# EAGLE design PCB-Extended (EAGLE 9.6.2)
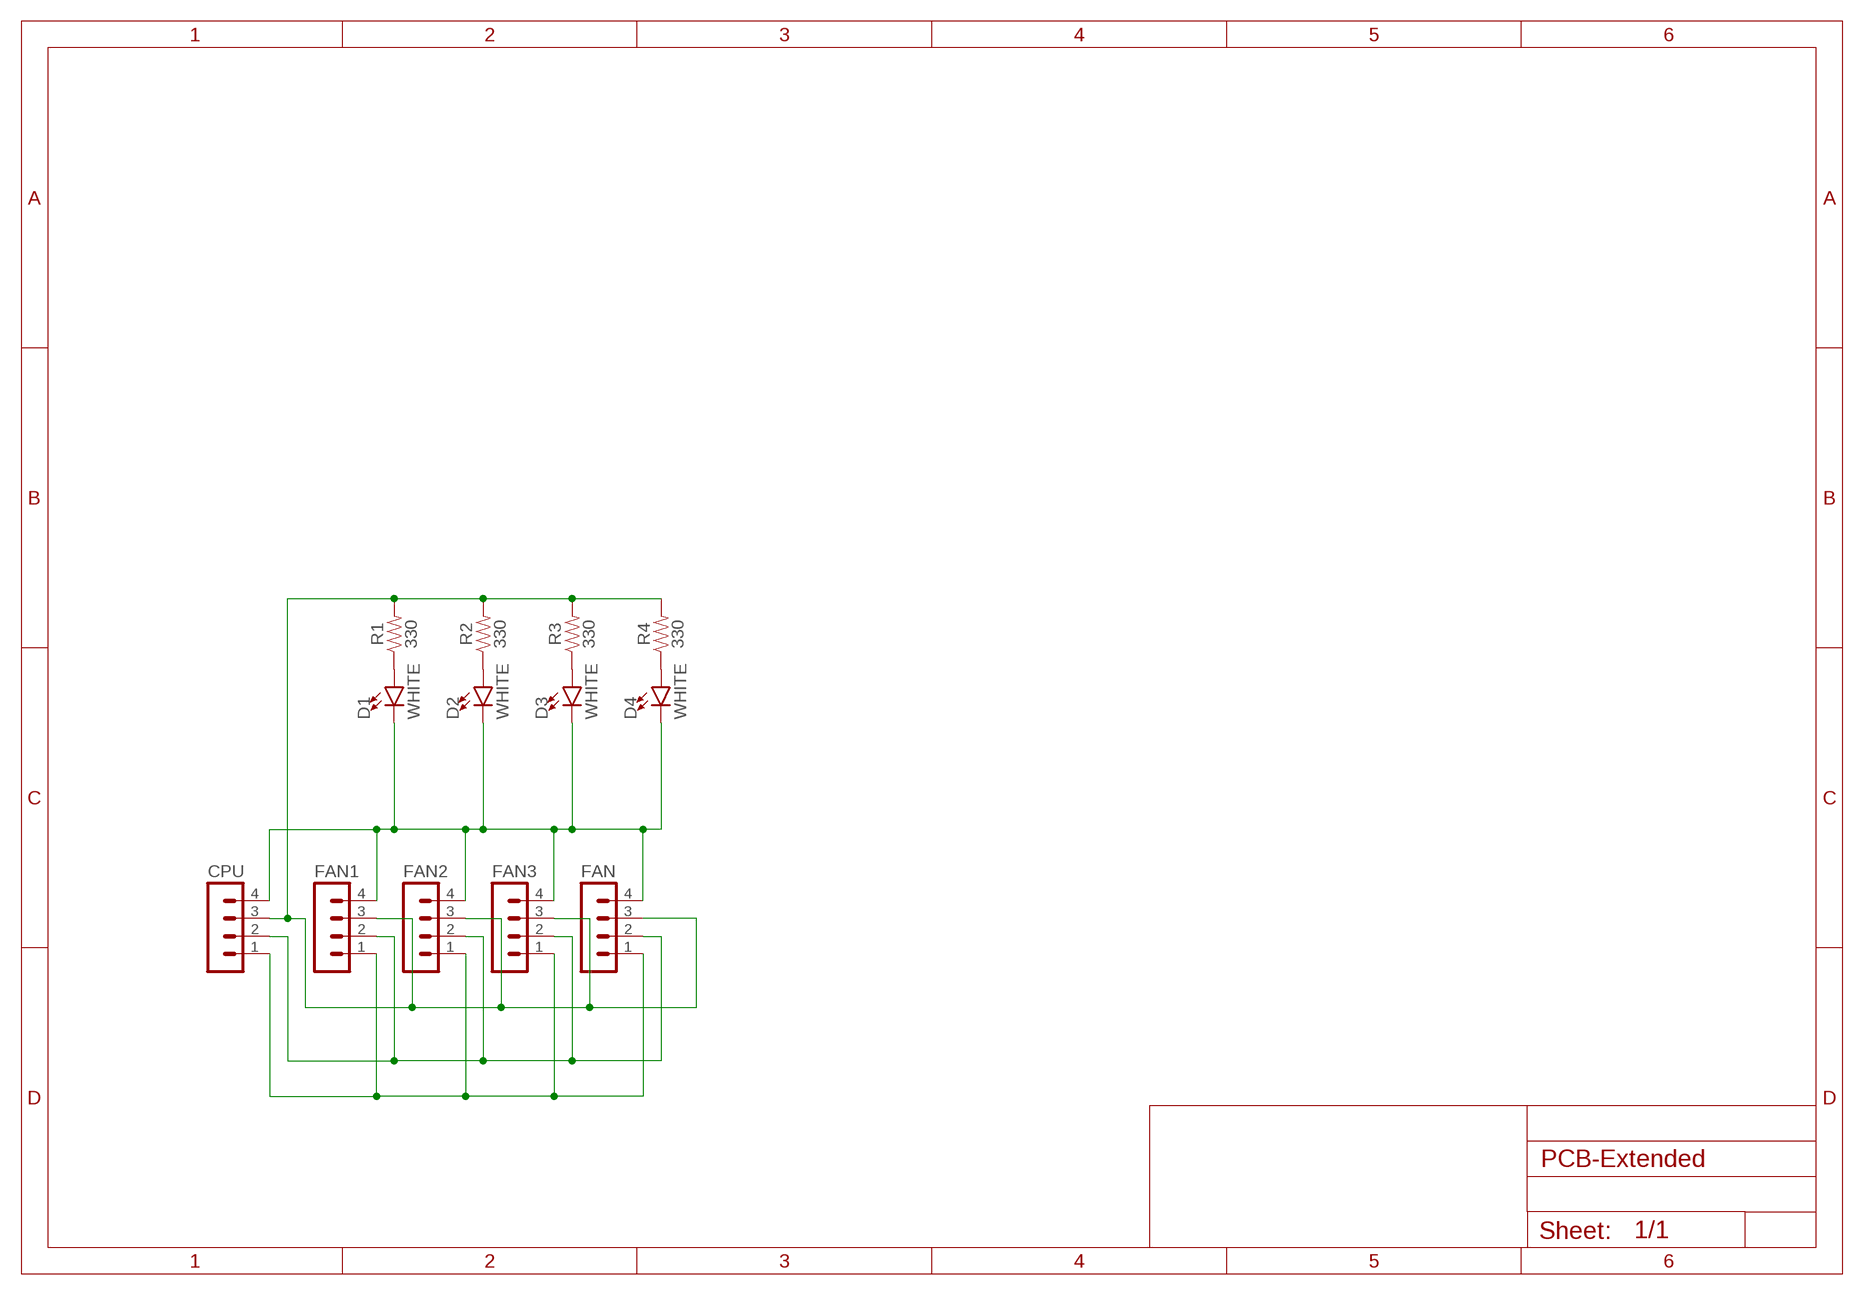
[diagram p0: schematic, sheet 1]

## Parts
CPU  MA04-1  [MA04-1]
D1  WHITE  LED-WHITE1206  [LED-1206]
D2  WHITE  LED-WHITE1206  [LED-1206]
D3  WHITE  LED-WHITE1206  [LED-1206]
D4  WHITE  LED-WHITE1206  [LED-1206]
FAN  MA04-1  [MA04-1]
FAN1  MA04-1  [MA04-1]
FAN2  MA04-1  [MA04-1]
FAN3  MA04-1  [MA04-1]
R1  330  0.27OHM-0603-1/10W-1%  [0603]
R2  330  0.27OHM-0603-1/10W-1%  [0603]
R3  330  0.27OHM-0603-1/10W-1%  [0603]
R4  330  0.27OHM-0603-1/10W-1%  [0603]

## Nets
FAN: CPU.2 FAN1.2 FAN2.2 FAN3.2 FAN.2
N$1: CPU.1 FAN1.1 FAN2.1 FAN3.1 FAN.1
N$6: CPU.4 D1.C D2.C D3.C D4.C FAN1.4 FAN2.4 FAN3.4 FAN.4
N$8: CPU.3 FAN1.3 FAN2.3 FAN3.3 FAN.3 R1.2 R2.2 R3.2 R4.2
N$9: D1.A R1.1
N$10: D2.A R2.1
N$11: D3.A R3.1
N$12: D4.A R4.1

## Library data of the parts
CPU FAN FAN1-FAN3 = con-lstb:MA04-1: PIN HEADER; OC_FARNELL: unknown; OC_NEWARK: unknown
D1-D4 = SparkFun-LED:LED-WHITE: White SMD LED Used in manufacturing several products at SparkFun. Packages: 0603 - Bright White SMD 0603 package[Product Link] <http://www.kingbrightusa.com/product.asp?catalog_name=LED&product_id=APT1608QWF/D> 1206 - Bright White SMD1206 package [Product Link] <http://www.kingbrightusa.com/product.asp?catalog_name=LED&product_id=APT3216QWF/D> 3014 - Super Bright SMD 3014 package [Datasheet] <http://www.lumileds.com/uploads/459/DS208-pdf> SparkFun Products: Blackberry Trackballer Breakout <https://www.sparkfun.com/products/13169> Digital SandBox <https://www.sparkfun.com/products/12651>; PROD_ID: DIO-09955
R1-R4 = SparkFun-Resistors:0.27OHM: 0.27Ω resistor A resistor is a passive two-terminal electrical component that implements electrical resistance as a circuit element. Resistors act to reduce current flow, and, at the same time, act to lower voltage levels within circuits. - Wikipedia; PROD_ID: RES-08787; VALUE: 0.27

## Board
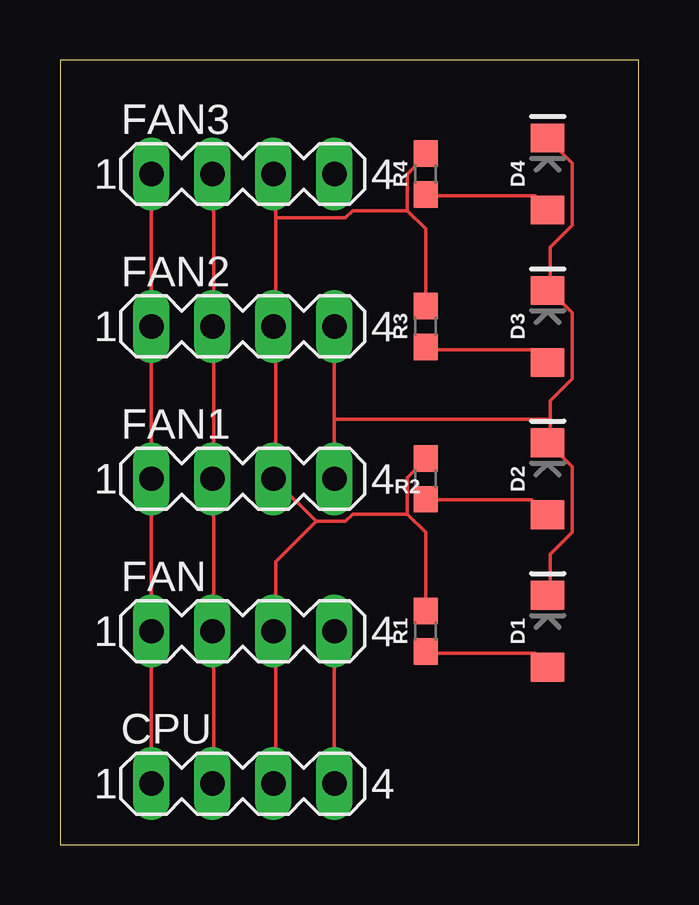
[diagram p1: board, top side]
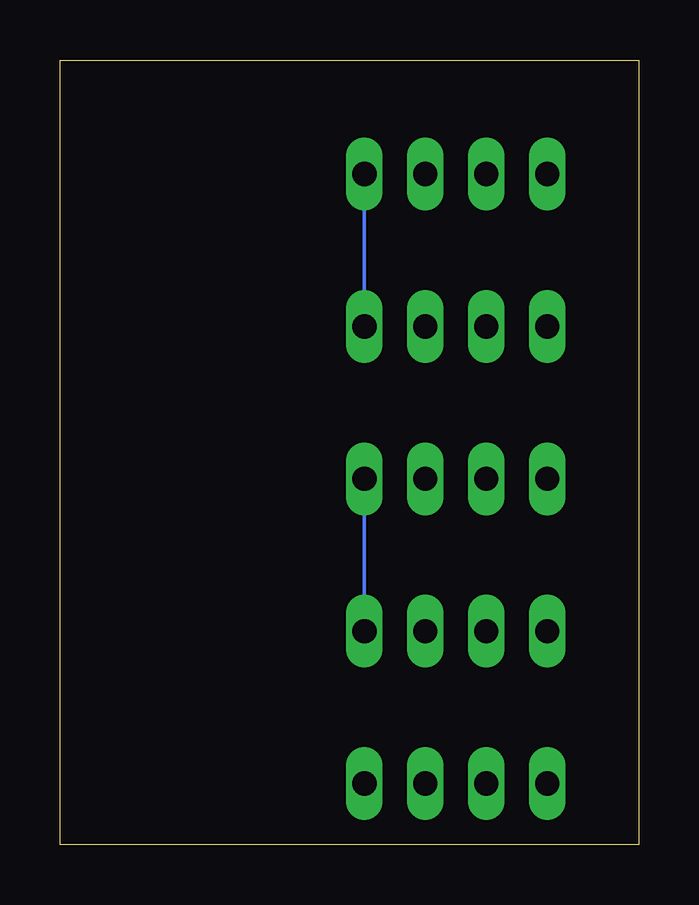
[diagram p2: board, bottom side, seen from below]

Size 24.11 x 32.69 mm. Coordinates in mm from the lower left corner, seen from the top.
Outline: 0,0 24.11,0 24.11,32.69 0,32.69 0,0
Copper layers (1*16): Top 0.035mm / dielectric 1.5mm / Bottom 0.035mm
Design rules "default": minimum track width 6mil, minimum drill 0.35mm, track to track 6mil, track to pad 6mil, pad to pad 6mil, via to via 6mil, smd to smd 6mil, copper to edge 40mil, drill to drill 6mil, minimum pad ring 10mil, minimum via ring 8mil, stop-mask expansion 4mil, vias tented up to drill 0mil, thermal gap 10mil

### Footprints (pad centres in the part's own frame; a part is rotated, then mirrored left to right if it is on the bottom)
MA04-1 = drill 1.016 long: 1 -3.81,0; 2 -1.27,0; 3 1.27,0; 4 3.81,0
LED-1206 = smd 1.2 x 1.4: A -1.5,0; C 1.5,0
0603 = smd 1.1 x 1: 1 -0.85,0; 2 0.85,0

### Placement (x,y rotation side)
CPU  7.62,2.54 0 top
D1  20.32,8.89 90 top
D2  20.32,15.24 90 top
D3  20.32,21.59 90 top
D4  20.32,27.94 90 top
FAN  7.62,8.89 0 top
FAN1  7.62,15.24 0 top
FAN2  7.62,21.59 0 top
FAN3  7.62,27.94 0 top
R1  15.24,8.89 90 top
R2  15.24,15.24 90 top
R3  15.24,21.59 90 top
R4  15.24,27.94 90 top

### Tracks (layer width: path | path; a pad name or v marks a point on that pad's centre or on a via)
FAN
  Top 0.152: 6.4,8.89 6.4,2.64 CPU.2 | FAN3.2 6.4,27.94 6.4,21.69 FAN2.2 6.4,21.54 6.4,15.29 FAN1.2 6.4,15.14 6.4,8.89 | 6.4,8.89 FAN.2
N$1
  Top 0.152: CPU.1 FAN.1 FAN1.1 FAN2.1 FAN3.1
N$6
  Top 0.152: D1.C 20.42,10.41 20.42,12.09 21.34,13.01 21.34,15.75 20.42,16.66 D2.C 20.42,16.82 20.42,17.73 | D4.C 20.42,29.31 21.34,28.4 21.34,25.81 20.42,24.89 20.42,23.22 D3.C 20.42,23.06 21.34,22.15 21.34,19.41 20.42,18.49 20.42,17.73 | FAN.4 CPU.4 | FAN2.4 11.43,17.73 | 11.43,17.73 FAN1.4 | 11.43,17.73 20.42,17.73
  Bottom 0.152: FAN2.4 FAN3.4 | FAN1.4 FAN.4
N$8
  Top 0.152: 8.99,8.89 8.99,2.64 CPU.3 | R3.2 15.24,25.65 14.48,26.42 | 14.48,26.42 14.48,27.94 15.24,28.7 R4.2 | R1.2 15.24,13.01 14.48,13.77 | 14.48,13.77 14.48,15.29 15.24,16.05 R2.2 | 8.99,26.11 8.99,21.69 FAN2.3 8.99,21.54 8.99,15.29 FAN1.3 10.67,13.46 | 8.99,26.11 8.99,27.94 FAN3.3 | 14.48,13.77 12.19,13.77 11.89,13.46 10.67,13.46 | 14.48,26.42 12.19,26.42 11.89,26.11 8.99,26.11 | 8.99,8.89 8.99,11.79 10.67,13.46 | 8.99,8.89 FAN.3
N$9
  Top 0.152: R1.1 15.24,7.98 19.81,7.98 20.27,7.52 D1.A
N$10
  Top 0.152: R2.1 15.24,14.38 19.66,14.38 20.27,13.77 D2.A
N$11
  Top 0.152: R3.1 15.24,20.62 19.81,20.62 20.27,20.17 D3.A
N$12
  Top 0.152: R4.1 15.24,27.03 19.81,27.03 20.27,26.57 D4.A